# EAGLE design TheButton (EAGLE 7.2.0)
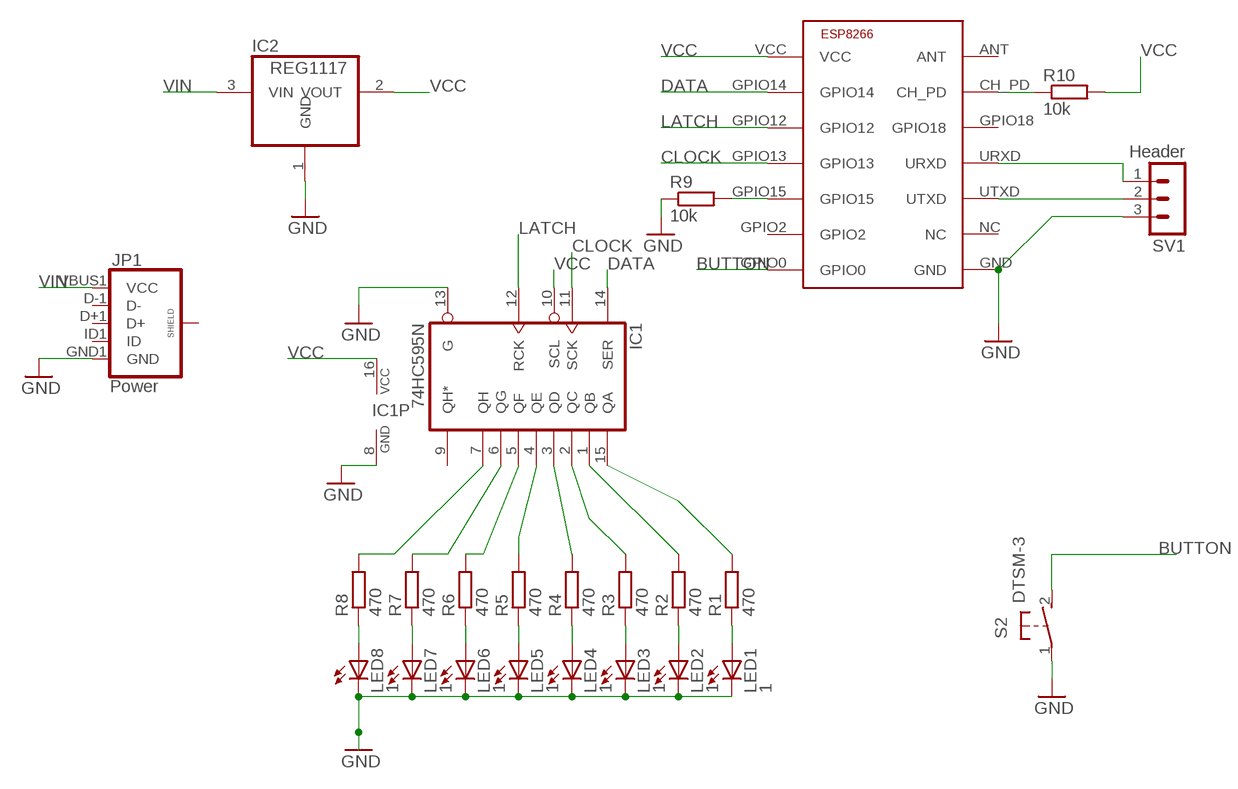
[diagram p0: schematic, sheet 1]

## Parts
IC1  74HC595N  [DIL16]
IC2  REG1117  [SOT223]
JP1  Power  USB_MICROB_PLUGCONN-11752  [USB-B-MICRO-SMD_V03]
LED1  1  LED3MM  [LED3MM]
LED2  1  LED3MM  [LED3MM]
LED3  1  LED3MM  [LED3MM]
LED4  1  LED3MM  [LED3MM]
LED5  1  LED3MM  [LED3MM]
LED6  1  LED3MM  [LED3MM]
LED7  1  LED3MM  [LED3MM]
LED8  1  LED3MM  [LED3MM]
R1  470  R-EU_0204/7  [0204/7]
R2  470  R-EU_0204/7  [0204/7]
R3  470  R-EU_0204/7  [0204/7]
R4  470  R-EU_0204/7  [0204/7]
R5  470  R-EU_0204/7  [0204/7]
R6  470  R-EU_0204/7  [0204/7]
R7  470  R-EU_0204/7  [0204/7]
R8  470  R-EU_0204/7  [0204/7]
R9  10k  R-EU_0204/5  [0204/5]
R10  10k  R-EU_0204/5  [0204/5]
S2  DTSM-3  [DTSM-3]
SV1  Header  MA03-1  [MA03-1]
U$1  ESP8266  [ESP-03]

## Nets
10KLOW: R9.2 U$1.GPIO15
BUTTON: S2.2 U$1.GPIO0
CLOCK: IC1.11(SCK) U$1.GPIO13
DATA: IC1.14(SER) U$1.GPIO14
GND: IC1.8(GND) IC1.13(G) IC2.1(GND) JP1.GND1(GND) LED1.K(C) LED2.K(C) LED3.K(C) LED4.K(C) LED5.K(C) LED6.K(C) LED7.K(C) LED8.K(C) R9.1 S2.1 SV1.3 U$1.GND
LATCH: IC1.12(RCK) U$1.GPIO12
N$1: LED1.A R1.1
N$2: LED8.A R8.1
N$3: LED7.A R7.1
N$4: LED6.A R6.1
N$5: LED5.A R5.1
N$6: LED4.A R4.1
N$7: LED3.A R3.1
N$8: LED2.A R2.1
N$9: IC1.15(QA) R1.2
N$10: IC1.1(QB) R2.2
N$11: IC1.2(QC) R3.2
N$12: IC1.3(QD) R4.2
N$13: IC1.4(QE) R5.2
N$14: R10.1 U$1.CH_PD
N$15: IC1.5(QF) R6.2
N$16: IC1.6(QG) R7.2
N$17: IC1.7(QH) R8.2
N$19: SV1.1 U$1.URXD
N$20: SV1.2 U$1.UTXD
VCC: IC1.10(SCL) IC1.16(VCC) IC2.2(VOUT) R10.2 U$1.VCC
VIN: IC2.3(VIN) JP1.VBUS1(VCC)
Unconnected: IC1.9(QH*) JP1.D+1(D+) JP1.D-1(D-) JP1.ID1(ID) JP1.SHIELD1(SHIELD) JP1.SHIELD2(SHIELD) JP1.SHIELD3(SHIELD) U$1.ANT U$1.GPIO2 U$1.GPIO18 U$1.NC

## Library data of the parts
IC1 = 74xx-eu:74*595: 8-bit SHIFT REGISTER, output latch
IC2 = burr-brown:REG1117: 800mA and 1A Low Dropout (LDO) Positive Regulator 1.8V, 2.5V, 2.85V, 3.3V, 5V, and Adj; MPN: REG1117; OC_FARNELL: 1097566; OC_NEWARK: 14P6981
JP1 = Murf:USB_MICROB_PLUG: USB Micro-B connectors Some male, some female. Watch your step!; PROD_ID: CONN-11752
LED1-LED8 = led:LED: LED OSRAM: - CHIPLED LG R971, LG N971, LY N971, LG Q971, LY Q971, LO R971, LY R971 LH N974, LH R974 LS Q976, LO Q976, LY Q976 LO Q996 - Hyper CHIPLED LW Q18S LB Q993, LB Q99A, LB R99A - SideLED LS A670, LO A670, LY A670, LG A670, LP A670 LB A673, LV A673, LT A673, LW A673 LH A674 LY A675 LS A676, LA A676, LO A676, LY A676, LW A676 LS A679, LY A679, LG A679 - Hyper Micro SIDELED® LS Y876, LA Y876, LO Y876, LY Y876 LT Y87S - SmartLED LW L88C, LW L88S LB L89C, LB L89S, LG L890 LS L89K, LO L89K, LY L89K LS L896, LA L896, LO L896, LY L896 - TOPLED LS T670, LO T670, LY T670, LG T670, LP T670 LSG T670, LSP T670, LSY T670, LOP T670, LYG T670 LG T671, LOG T671, LSG T671 LB T673, LV T673, LT T673, LW T673 LH T674 LS T676, LA T676, LO T676, LY T676, LB T676, LH T676, LSB T676, LW T676 LB T67C, LV T67C, LT T67C, LS T67K, LO T67K, LY T67K, LW E67C LS E67B, LA E67B, LO E67B, LY E67B, LB E67C, LV E67C, LT E67C LW T67C LS T679, LY T679, LG T679 LS T770, LO T770, LY T770, LG T770, LP T770 LB T773, LV T773, LT T773, LW T773 LH T774 LS E675, LA E675, LY E675, LS T675 LS T776, LA T776, LO T776, LY T776, LB T776 LHGB T686 LT T68C, LB T68C - Hyper Mini TOPLED® LB M676 - Mini TOPLED Santana® LG M470 LS M47K, LO M47K, LY M47K Source: http://www.osram.convergy.de LUXEON: - LUMILED® LXK2-PW12-R00, LXK2-PW12-S00, LXK2-PW14-U00, LXK2-PW14-V00 LXK2-PM12-R00, LXK2-PM12-S00, LXK2-PM14-U00 LXK2-PE12-Q00, LXK2-PE12-R00, LXK2-PE12-S00, LXK2-PE14-T00, LXK2-PE14-U00 LXK2-PB12-K00, LXK2-PB12-L00, LXK2-PB12-M00, LXK2-PB14-N00, LXK2-PB14-P00, LXK2-PB14-Q00 LXK2-PR12-L00, LXK2-PR12-M00, LXK2-PR14-Q00, LXK2-PR14-R00 LXK2-PD12-Q00, LXK2-PD12-R00, LXK2-PD12-S00 LXK2-PH12-R00, LXK2-PH12-S00 LXK2-PL12-P00, LXK2-PL12-Q00, LXK2-PL12-R00 Source: www.luxeon.com KINGBRIGHT: KA-3528ASYC Source: www.kingbright.com
R1-R10 = rcl:R-EU_: RESISTOR, European symbol
S2 = switch-tact:DTSM-3
SV1 = con-lstb:MA03-1: PIN HEADER; OC_FARNELL: unknown; OC_NEWARK: unknown
U$1 = ESP8266:ESP8266: low cost Wifi to Serial Module

## Board
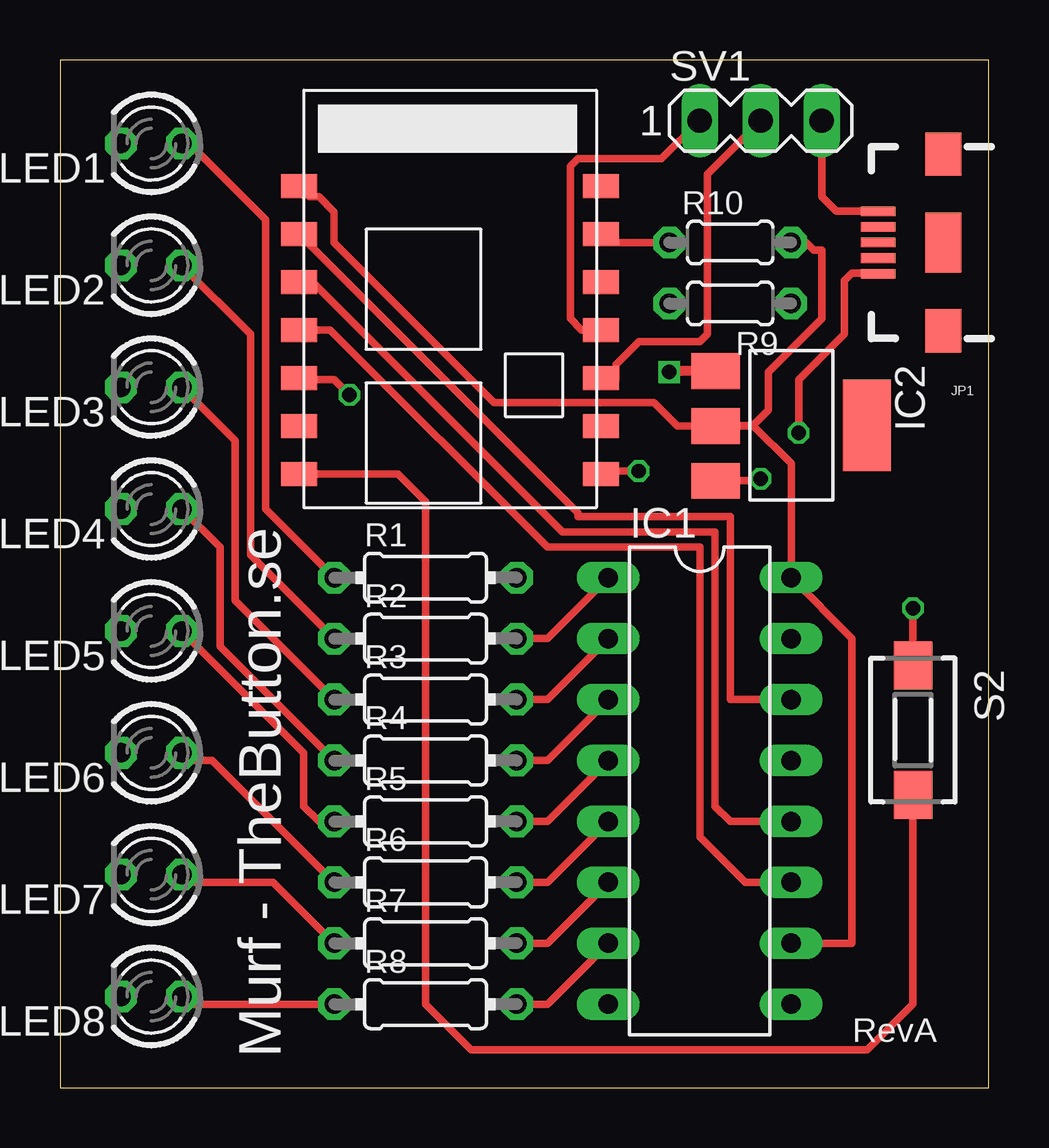
[diagram p1: board, top side]
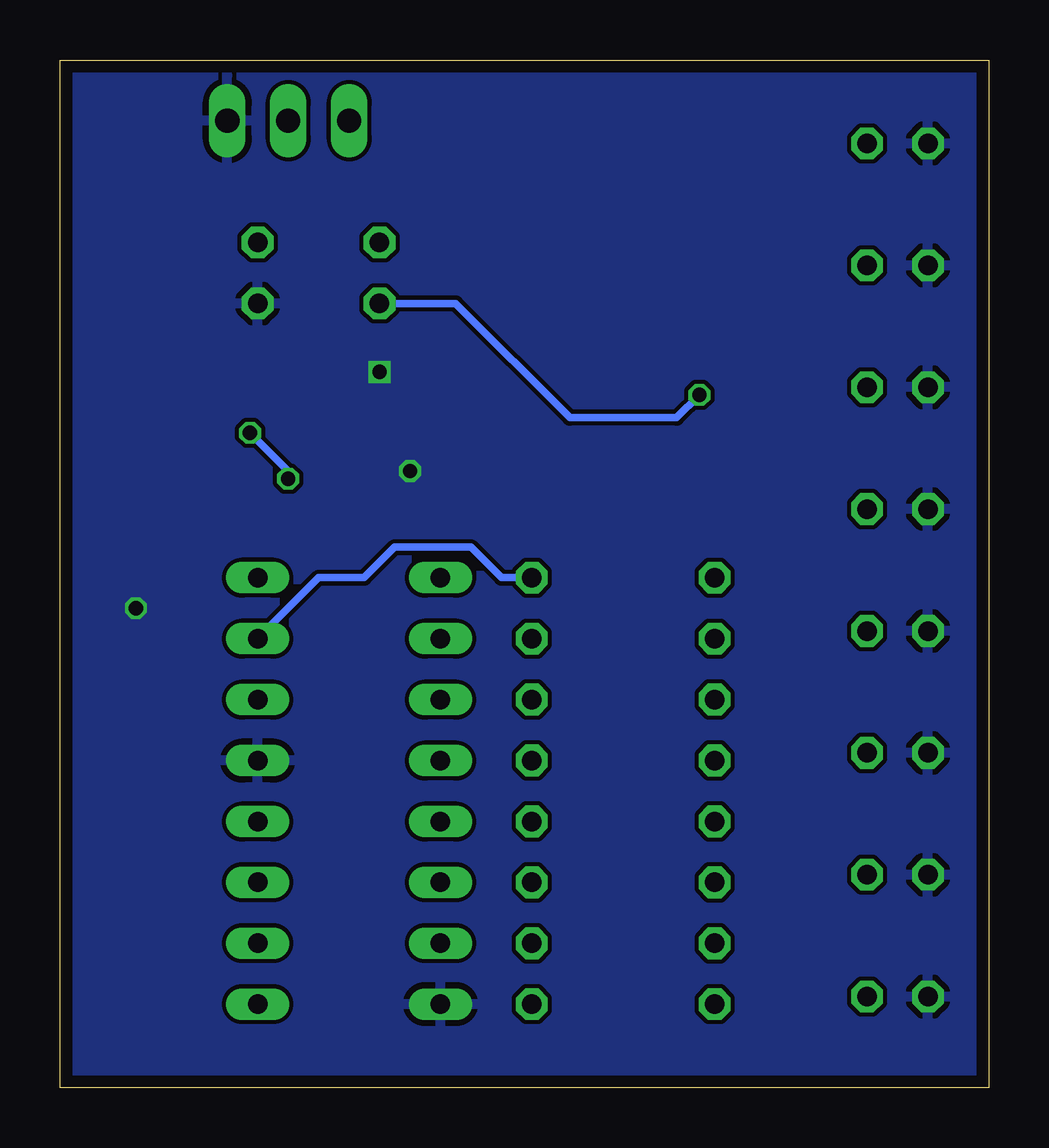
[diagram p2: board, bottom side, seen from below]

Size 38.72 x 42.85 mm. Coordinates in mm from the lower left corner, seen from the top.
Outline: 0,0 38.72,0 38.72,42.85 0,42.85 0,0
Copper layers (1*16): Top 0.035mm / dielectric 1.5mm / Bottom 0.035mm
Design rules "smart-prototyping.com.EagleRules": minimum track width 7mil, minimum drill 12mil, track to track 7mil, track to pad 7mil, pad to pad 7mil, via to via 7mil, smd to smd 0mil, copper to edge 20mil, drill to drill 10mil, minimum pad ring 10mil, minimum via ring 6mil, stop-mask expansion 2mil, vias tented up to drill 25mil, thermal gap 10mil

### Footprints (pad centres in the part's own frame; a part is rotated, then mirrored left to right if it is on the bottom)
DIL16 = drill 0.813 long: 1 -8.89,-3.81; 2 -6.35,-3.81; 3 -3.81,-3.81; 4 -1.27,-3.81; 5 1.27,-3.81; 6 3.81,-3.81; 7 6.35,-3.81; 8 8.89,-3.81; 9 8.89,3.81; 10 6.35,3.81; 11 3.81,3.81; 12 1.27,3.81; 13 -1.27,3.81; 14 -3.81,3.81; 15 -6.35,3.81; 16 -8.89,3.81
SOT223 = smd 1.499 x 2.007: 1 -2.261,-3.15; 2 0.025,-3.15; 3 2.311,-3.15 | smd 3.81 x 2.007: 4 0,3.15
USB-B-MICRO-SMD_V03 = smd 1.45 x 0.4: D+1 2.725,0; D-1 2.725,0.65; GND1 2.725,-1.3; ID1 2.725,-0.65; VBUS1 2.725,1.3 | smd 1.5 x 1.8: SHIELD1 0,3.685; SHIELD2 0,-3.685 | smd 1.5 x 2.5: SHIELD3 0,0
LED3MM = drill 0.813 octagon: A -1.27,0; K 1.27,0
0204/7 = drill 0.813 octagon: 1 -3.81,0; 2 3.81,0
0204/5 = drill 0.813 octagon: 1 -2.54,0; 2 2.54,0
DTSM-3 = smd 2 x 1.6: 1 -2.7,0; 2 2.7,0
MA03-1 = drill 1.016 long: 1 -2.54,0; 2 0,0; 3 2.54,0
ESP-03 = smd 1 x 1.5: ANT 4,12.4; CH_PD 6,12.4; GND 16,12.4; GPIO0 16,-0.2; GPIO2 14,-0.2; GPIO12 8,-0.2; GPIO13 10,-0.2; GPIO14 6,-0.2; GPIO15 12,-0.2; GPIO18 8,12.4; NC 14,12.4; URXD 10,12.4; UTXD 12,12.4; VCC 4,-0.2

### Placement (x,y rotation side)
IC1  26.67,12.38 270 top
IC2  30.48,27.62 270 top
JP1  36.83,35.24 180 top
LED1  3.81,39.37 180 top
LED2  3.81,34.29 180 top
LED3  3.81,29.21 180 top
LED4  3.81,24.13 180 top
LED5  3.81,19.05 180 top
LED6  3.81,13.97 180 top
LED7  3.81,8.89 180 top
LED8  3.81,3.81 180 top
R1  15.24,21.27 0 top
R2  15.24,18.73 0 top
R3  15.24,16.19 0 top
R4  15.24,13.65 0 top
R5  15.24,11.11 0 top
R6  15.24,8.57 0 top
R7  15.24,6.03 0 top
R8  15.24,3.49 0 top
R9  27.94,32.7 180 top
R10  27.94,35.24 0 top
S2  35.56,14.92 270 top
SV1  29.21,40.32 0 top
U$1  10.16,41.59 270 top

### Tracks (layer width: path | path; a pad name or v marks a point on that pad's centre or on a via)
10KLOW  (via drill 0.6)
  Top 0.305: 10.03,29.53 U$1.GPIO15 10.41,29.59 10.48,29.53 11.43,29.53 v12.06,28.89
  Bottom 0.305: v12.06,28.89 13.02,27.94 17.46,27.94 22.23,32.7 R9.2
BUTTON
  Top 0.305: 10.15,25.4 U$1.GPIO0 14.1,25.59 15.24,24.45 15.24,3.49 17.14,1.59 33.66,1.59 35.56,3.49 S2.2
CLOCK
  Top 0.305: IC1.11 28.57,8.57 26.67,10.48 26.67,22.54 20.32,22.54 11.27,31.59 U$1.GPIO13
DATA
  Top 0.305: IC1.14 27.94,16.19 27.94,23.81 21.59,23.81 21.59,23.96 U$1.GPIO14
GND  (via drill 0.6)
  Top 0.305: U$1.GND 22.68,25.72 v24.13,25.72 | SV1.3 31.75,37.15 32.35,36.54 JP1.GND1 | v35.56,20 S2.1
  Top 0.406: IC2.1 25.4,29.88 v25.4,29.84
  pour Bottom: -1.27,44.13 -1.27,-1.59 22.86,-1.59 22.86,-2.86 40.64,-2.86 40.64,-0.32 41.91,-0.32 41.91,44.13
LATCH
  Top 0.305: IC1.12 27.94,11.11 27.3,11.75 27.3,23.18 20.95,23.18 10.54,33.59 U$1.GPIO12
N$1
  Top 0.305: R1.1 8.57,24.13 8.57,36.2 5.4,39.37 LED1.A
N$2
  Top 0.305: LED8.A 5.4,3.49 R8.1
N$3
  Top 0.305: LED7.A 5.4,8.57 8.89,8.57 R7.1
N$4
  Top 0.305: LED6.A 5.4,13.65 6.35,13.65 R6.1
N$5
  Top 0.305: LED5.A 10.16,13.97 10.16,11.75 10.79,11.11 R5.1
N$6
  Top 0.305: LED4.A 6.67,22.54 6.67,18.41 R4.1
N$7
  Top 0.305: LED3.A 7.3,26.99 7.3,20.32 R3.1
N$8
  Top 0.305: LED2.A 7.94,31.43 7.94,22.23 R2.1
N$9
  Bottom 0.305: IC1.15 27.94,21.27 26.04,21.27 24.77,22.54 21.59,22.54 20.32,21.27 R1.2
N$10
  Top 0.305: IC1.1 20.32,18.73 R2.2
N$11
  Top 0.305: IC1.2 20.32,16.19 R3.2
N$12
  Top 0.305: IC1.3 20.32,13.65 R4.2
N$13
  Top 0.305: IC1.4 20.32,11.11 R5.2
N$14
  Top 0.305: R10.1 22.91,35.24 U$1.CH_PD
N$15
  Top 0.305: IC1.5 20.32,8.57 R6.2
N$16
  Top 0.305: IC1.6 20.32,6.03 R7.2
N$17
  Top 0.305: IC1.7 20.32,3.49 R8.2
N$19
  Top 0.305: SV1.1 25.08,38.73 21.59,38.73 21.27,38.42 21.27,32.07 21.75,31.59 U$1.URXD
N$20
  Top 0.305: SV1.2 26.99,38.1 26.99,31.43 26.67,31.11 24.13,31.11 23.18,30.16 23.18,29.53 23.11,29.59 U$1.UTXD
VCC
  Top 0.305: IC1.10 33.02,6.03 33.02,18.73 IC1.16 30.48,26.04 28.89,27.62 | U$1.VCC 10.4,37.15 10.79,37.15 11.43,36.51 11.43,35.24 18.1,28.57 24.77,28.57 25.74,27.6 IC2.2 | R10.2 31.11,35.24 31.43,34.92 31.75,34.92 31.75,32.07 29.53,29.84 29.53,28.26 28.89,27.62 | 28.89,27.62 28.87,27.6 IC2.2 | IC2.2 27.36,27.62 28.89,27.62
VIN  (via drill 0.6)
  Top 0.305: 26.92,25.72 IC2.3 29.12,25.31 v29.21,25.4 | JP1.VBUS1 34.08,33.97 33.02,33.97 32.7,33.66 32.7,31.43 30.8,29.53 v30.8,27.3
  Bottom 0.305: v30.8,27.3 29.21,25.72 v29.21,25.4

### Text on the board
tPlace: RevA | Murf - TheButton.se